# Altium schematic sheet Copy of 5 and -5 Supply Switches.SchDoc
size A; SheetNumber: 4; SheetTotal: 7
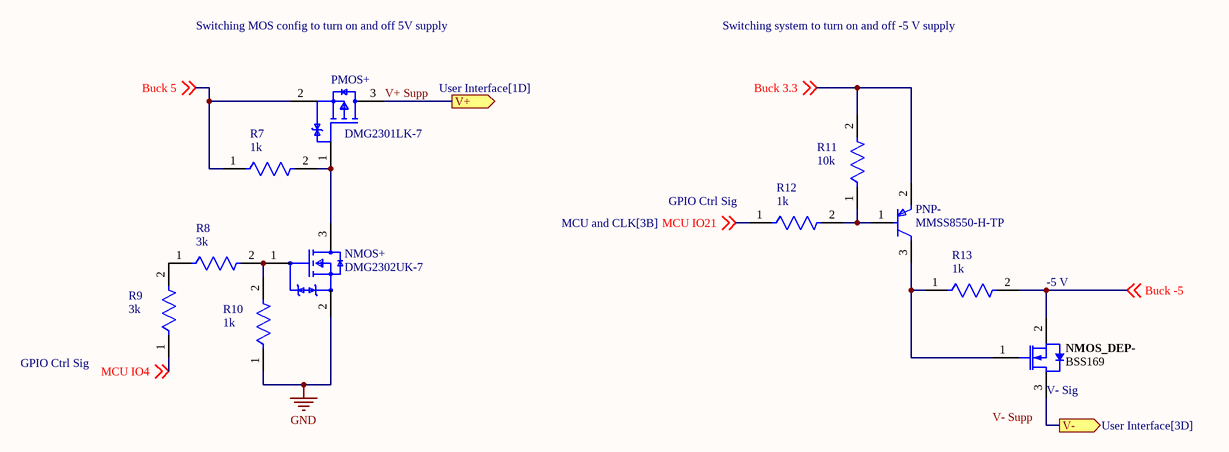
[diagram p0: Copy of 5 and -5 Supply Switches.SchDoc]

## Parts
NMOS+  DMG2302UK-7  [FP-SOT23-MFG]
NMOS_DEP-  BSS169  [INF-PG-SOT23_N]
PMOS+  DMG2301LK-7  [FP-SOT23-IPC_B]
PNP-  MMSS8550-H-TP  [FP-SOT-23-IPC_B]
R7  1k  [FP-RNCP0805-MFG]
R8  3k  [FP-CR0805-IPC_B]
R9  3k  [FP-CR0805-IPC_B]
R10  1k  [FP-RNCP0805-MFG]
R11  10k  [FP-RK73H1J-IPC_B]
R12  1k  [FP-RNCP0805-MFG]
R13  1k  [FP-RNCP0805-MFG]

## Ports
V+ (out, see User Interface[1D]), V- (out, see User Interface[3D])

## Nets
GND: NMOS+.2(S) R10.1
Buck 3.3: PNP-.2(E) R11.2 ; off-sheet Buck 3.3
Buck 5: PMOS+.2(S) R7.1 ; off-sheet Buck 5
Buck -5: NMOS_DEP-.2(SOURCE) R13.2 ; off-sheet Buck -5
MCU IO4: R9.1 ; off-sheet MCU IO4
MCU IO21: R12.1 ; off-sheet MCU IO21
V+ Supp: PMOS+.3(D) ; port V+
V-: NMOS_DEP-.3(DRAIN) ; port V-
NetNMOS+_1: NMOS+.1(G) R8.2 R10.2
NetNMOS+_3: NMOS+.3(D) PMOS+.1(G) R7.2
NetNMOS_DEP-_1: NMOS_DEP-.1(GATE) PNP-.3(C) R13.1
NetPNP-_1: PNP-.1(B) R11.1 R12.2
NetR8_1: R8.1 R9.2

## Notes on the sheet
- Switching MOS config to turn on and off 5V supply
- Switching system to turn on and off -5 V supply
- (near R12) GPIO Ctrl Sig
- -5 V
- GPIO Ctrl Sig
- (near NMOS_DEP-) V- Sig
- Labels drawn without touching a wire or pin: V- Supp

## Library data of the parts
NMOS+ = CMP-12801-000001-1: MOSFET N-CH 20V 2.8A SOT23; Manufacturer: Diodes Inc.; Reverse Recovery Time: 5.3ns; Gate Charge At Vgs: 2.8nC @ 10V; Turn On Delay Time: 0.6ns; Pulse Drain Current: 12A; Max Forward Diode Voltage: 1.2V; Reverse Recovery Charge: 0.5nC; Automotive Grade: Grade 0; Threshold Vgs Min: 0.3V; Number Of N Channels: 1; Standoff Height: 0.013mm; Typ Forward Diode Voltage: 0.7V; Drain To Source Resistance: 61mΩ; Rthja Max: 192°C/W; Max Junction Temp: +150°C; Input Capacitace At Vds: 130pF @ 10V; Threshold Vgs Max: 1V; Turn Off Delay Time: 4.2ns; Depletion Mode: False; Gate To Source Voltage: 12V; Power Dissipation: 0.66W; Device Class L1: Discrete Semiconductors; Footprint Url: https://www.diodes.com/assets/Package-Files/SOT23.pdf; Lead Free: Yes; Manufacturer Part Number: DMG2302UK-7; Temperature Range High: +150°C; Drain To Source Voltage: 20V; Category: Trans; Digikey Description: MOSFET N-CH 20V 2.8A SOT23; RoHS: TRUE; Device Class L2: Transistors; Height: 1.1mm; Automotive: Yes; Package: SOT23; Drain To Source Breakdown Voltage: 20V; Continuous Drain Current: 2.8A; ComponentLink2Description: Datasheet; Device Class L3: MOSFETs; Octopart: https://octopart.com/dmg2302uk-7-diodes+inc.-73850182; Temperature Range Low: -55°C; Temperature: -55°C to +150°C; Number Of Channels: 1; ComponentLink2URL: https://www.diodes.com/assets/Datasheets/DMG2302UK.pdf
NMOS_DEP- = CMP-1153-00006-1: N-Channel SIPMOS Small-Signal-Transistor, 100 V VDS, 0.17 A ID, -55 to 150 degC, PG-SOT23, Reel, Green; Manufacturer: Infineon; RDS (on)(max): 6 Ohm; Green: TRUE; RthJC(max): 350 K/W; ID(max): 0.17Â A; Mode: Depletion; IDpuls(max): 0.68Â A; QG: 2.1Â nC; Ptot(max): 0.36Â W; VGS(th)(max): -1.8Â V; VGS(th)(min): -2.9Â V; VDS (max): 100 V; ComponentLink1Description: Manufacturer URL; Halogen-free: TRUE; PackageDescription: 3-Pin Small Outline Transistor Package, 2.9 x 1.3 mm Body, 0.95 mm Pitch; DatasheetVersion: Rev. 1.8; ComponentLink2URL: http://www.infineon.com/dgdl/BSS169_Rev1.8_.pdf?folderId=db3a3043156fd573011622e10b5c1f67&fileId=db3a304330f68606013108f39406004c; PackageVersion: Apr-08; ComponentLink2Description: Datasheet; ComponentLink1URL: http://www.infineon.com/; Technology: SIPMOS; ComponentLink3URL: http://www.infineon.com/dgdl/SOT23-Package_Overview.pdf?folderId=db3a30431936bc4b0119532290053c66&fileId=db3a30431936bc4b0119533468123c85; PackageReference: PG-SOT23; Packing: Reel; Mounting Technology: Surface Mount; ComponentLink3Description: Package Specification; PartNumber: BSS169
PMOS+ = CMP-12801-000081-1: MOSFET P-CHA 20V 2.4A SOT23; Rds On Max: 160mR; Input Capacitance: 156pF; Max Power Dissipation: 840mW; Continuous Drain Current (ID): 2.4A; Max Operating Temperature: 150°C; Packaging: Tape and Reel; Case/Package: TO-236-3; Drain to Source Voltage (Vdss): 20V; Min Operating Temperature: -55°C; Mount: Surface Mount
PNP- = CMP-56214-000002-1: TRANS PNP 25V 1.5A SOT23; Emitter Base Voltage (VEBO): 1.6V; Collector Base Voltage (VCBO): 40V; Collector Emitter Saturation Voltage: 500mV; Max Power Dissipation: 625mW; Transition Frequency: 100MHz; Element Configuration: Single; hFE Min: 40; Polarity: PNP; Lead Free: Lead Free; Max Breakdown Voltage: 25V; Package Quantity: 1; Min Operating Temperature: -55°C; Case/Package: SOT-23; Max Collector Current: 1.5A; Mount: Surface Mount; Packaging: Tape and Reel; Collector Emitter Voltage (VCEO): 500mV; Max Operating Temperature: 150°C; Gain Bandwidth Product: 100MHz; Collector Emitter Breakdown Voltage: 25V
R7 R10 R12 R13 = CMP-26527-001902-1: 1kΩ ±1% 0.25W 0805 High Power Anti-Sulfur Thin Film Chip Resistor; Resistance: 1kR; Power Rating: 250mW; Temperature Coefficient: 100ppm/°C; Series: RNCP; RoHS Compliant: Yes; Case Code (Metric): 2012; Length: 0.079inch; Case/Package: 0805; Max Power Dissipation: 250mW; Height: 0.024inch; Size Code: 0805; Max Operating Temperature: 155°C; Tolerance: 1%; Min Operating Temperature: -55°C; Width: 0.049inch; Case Code (Imperial): 0805; Packaging: Tape and Reel; Mount: Surface Mount; Features: Moisture Resistant; Lead Free: Lead Free; Resistor Type: Thin Film; Number of Terminations: 2
R8 R9 = CMP-07231-007176-1: Thick Film Chip Resistors 0805 3kΩ 0.125W 1% 100ppm/°C; Resistance: 3kR; Power Rating: 125mW; Voltage Rating: 150V; Width: 0.049inch; Military Standard: Not; Radiation Hardening: No; Termination: SMD/SMT; Temperature Coefficient: 100ppm/°C; Max Operating Temperature: 155°C; Length: 2mm; Tolerance: 1%; Thickness: 508um; Case Code (Imperial): 0805; Depth: 1.25mm; Case/Package: 0805; Package Quantity: 5000; Mount: Surface Mount; Max Power Dissipation: 125mW; Resistor Type: Thick Film; Series: CR0805; Packaging: Tape and Reel; Contact Plating: Tin; RoHS Compliant: Yes; Min Operating Temperature: -55°C; Construction: Rectangular; Height: 0.024inch; Case Code (Metric): 2012; Features: Moisture Resistant; Number of Terminations: 2
R11 = CMP-2000-01751-2: 10kΩ ±1% 0.1W Chip Resistor 0603 Thick Film AEC-Q200 Qualified; Power Rating: 100mW; Temperature Coefficient: 100ppm/°C; Resistance: 10kR; Voltage Rating: 50V; Construction: Rectangular; Max Operating Temperature: 155°C; Resistor Type: Thick Film; Case/Package: 0603; Military Standard: MIL-R-55342F; Depth: 0.8mm; Termination: SMD/SMT; Min Operating Temperature: -55°C; RoHS Compliant: Yes; Width: 0.8mm; Length: 1.6mm; Height: 0.45mm; Case Code (Metric): 1608; Package Quantity: 10000; Lead Free: Lead Free; Series: RK73H; Packaging: Tape and Reel; Case Code (Imperial): 0603; Tolerance: 1%